# EAGLE design Sensor_board (EAGLE 7.7.0)
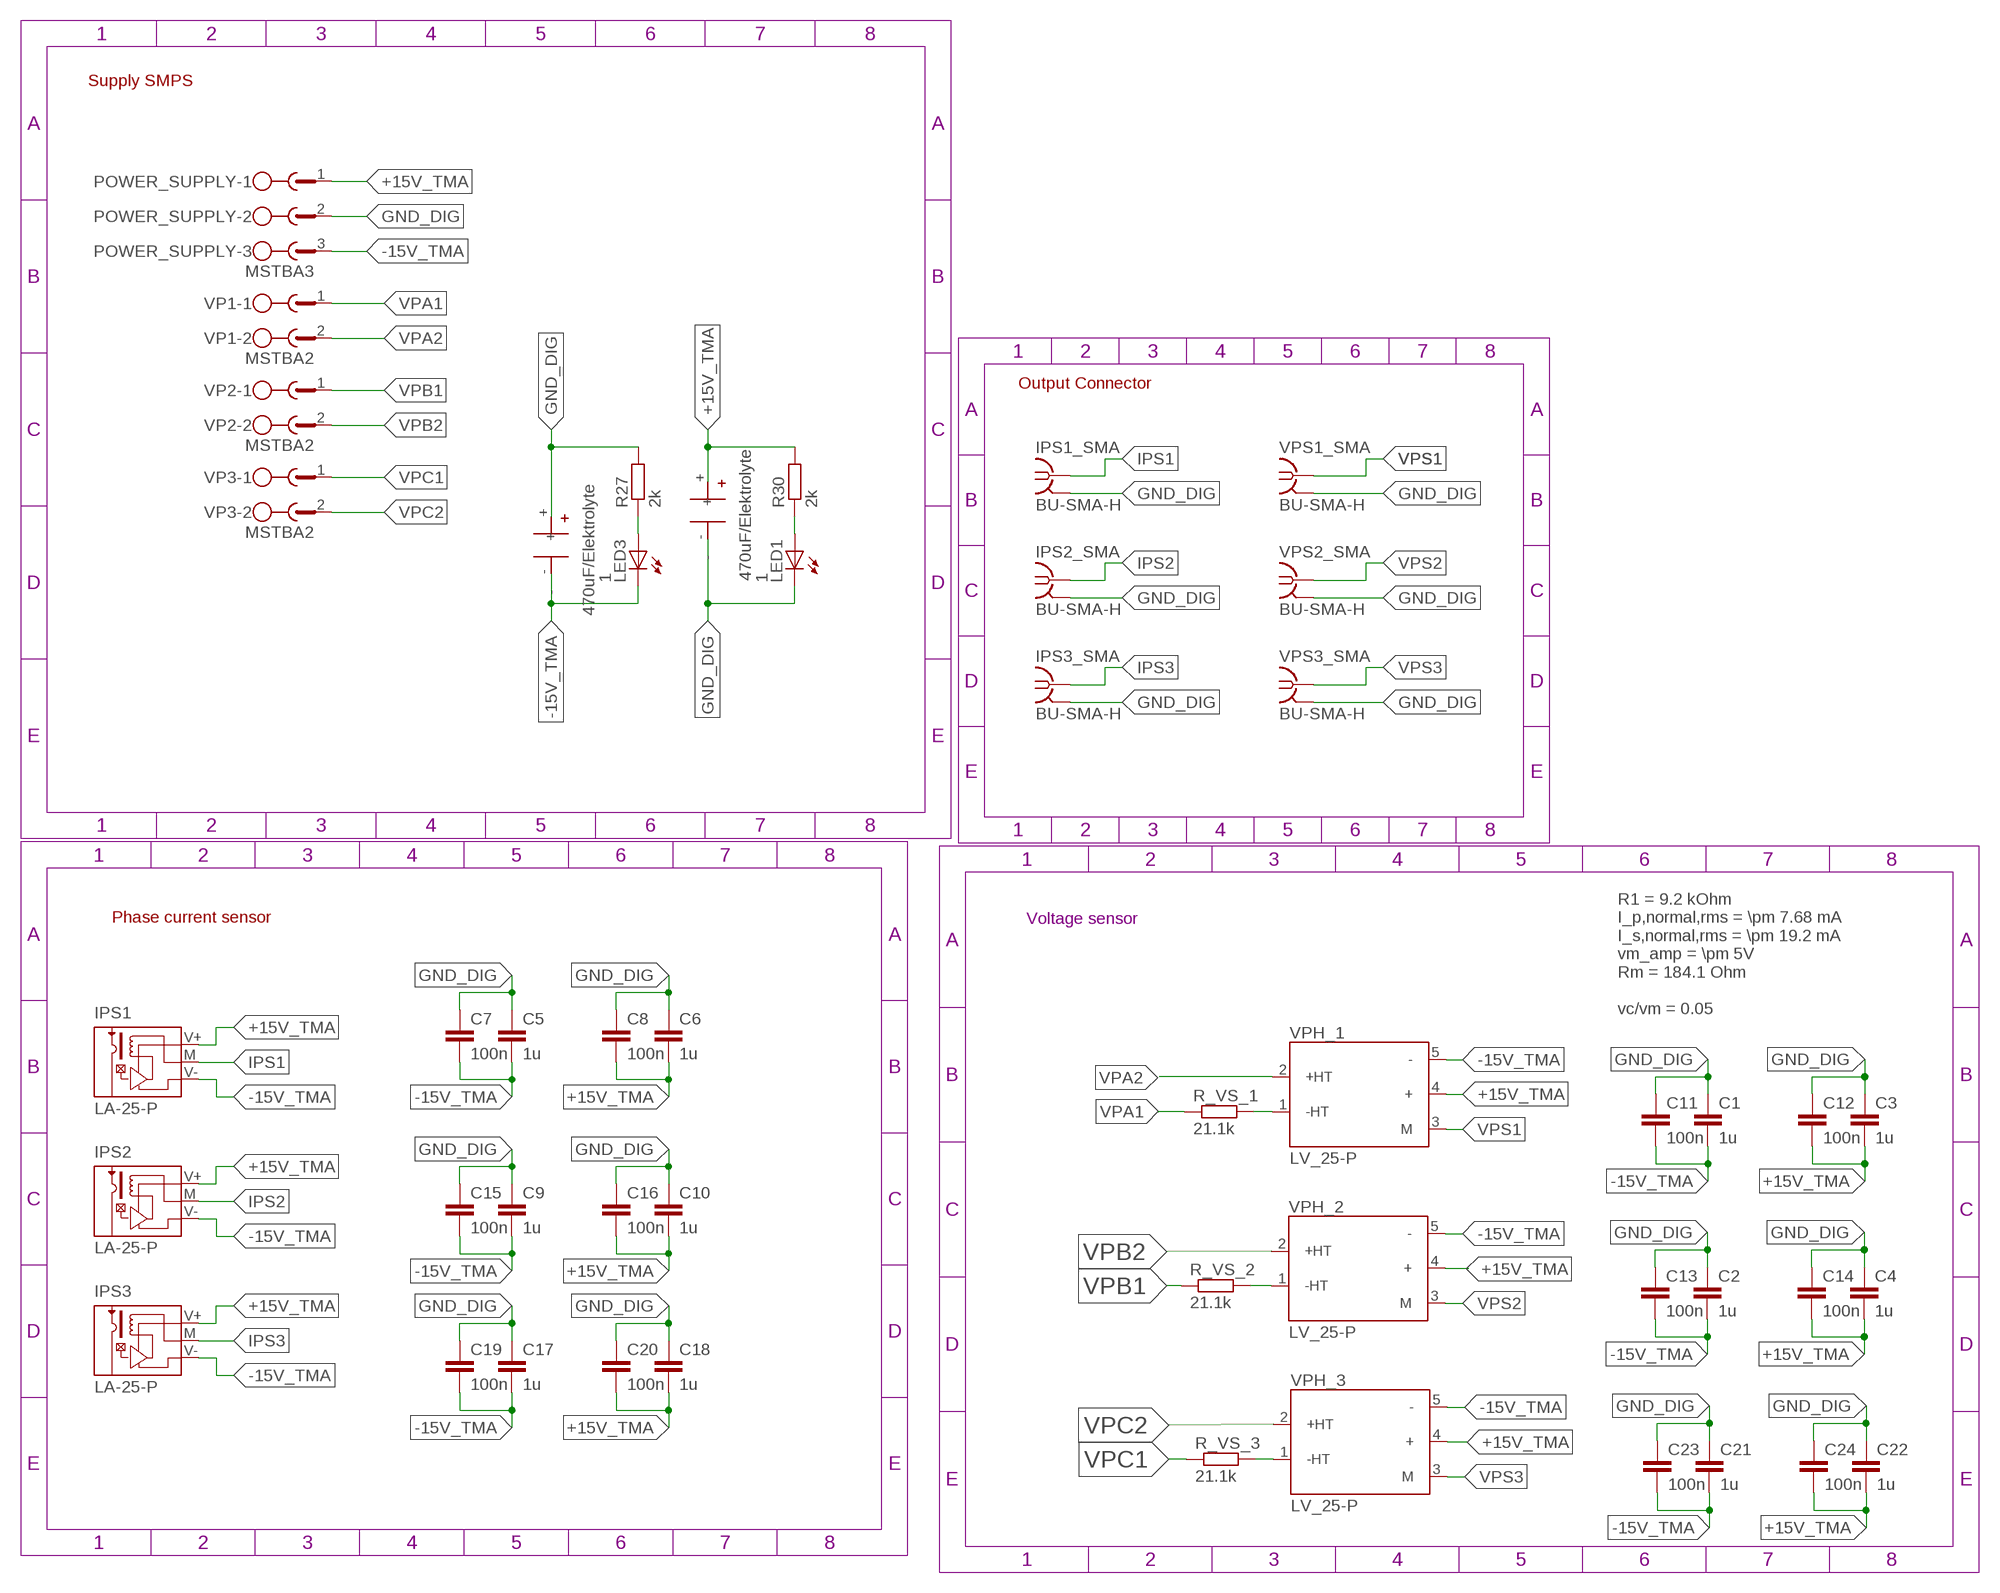
[diagram p0: schematic, sheet 1]

## Parts
C1  1u  C-EUC0805  [C0805]
C2  1u  C-EUC0805  [C0805]
C3  1u  C-EUC0805  [C0805]
C4  1u  C-EUC0805  [C0805]
C5  1u  C-EUC0805  [C0805]
C6  1u  C-EUC0805  [C0805]
C7  100n  C-EUC0805  [C0805]
C8  100n  C-EUC0805  [C0805]
C9  1u  C-EUC0805  [C0805]
C10  1u  C-EUC0805  [C0805]
C11  100n  C-EUC0805  [C0805]
C12  100n  C-EUC0805  [C0805]
C13  100n  C-EUC0805  [C0805]
C14  100n  C-EUC0805  [C0805]
C15  100n  C-EUC0805  [C0805]
C16  100n  C-EUC0805  [C0805]
C17  1u  C-EUC0805  [C0805]
C18  1u  C-EUC0805  [C0805]
C19  100n  C-EUC0805  [C0805]
C20  100n  C-EUC0805  [C0805]
C21  1u  C-EUC0805  [C0805]
C22  1u  C-EUC0805  [C0805]
C23  100n  C-EUC0805  [C0805]
C24  100n  C-EUC0805  [C0805]
C31  ELE_C_470UF_PAN  [ELEK_C_470UF_PAN]
C32  ELE_C_470UF_PAN  [ELEK_C_470UF_PAN]
IPS1  LA-25-P  [LA25P]
IPS1_SMA  BU-SMA-H  [BU-SMA-H]
IPS2  LA-25-P  [LA25P]
IPS2_SMA  BU-SMA-H  [BU-SMA-H]
IPS3  LA-25-P  [LA25P]
IPS3_SMA  BU-SMA-H  [BU-SMA-H]
LED1  1  LEDCHIPLED_0805  [CHIPLED_0805]
LED3  1  LEDCHIPLED_0805  [CHIPLED_0805]
POWER_SUPPLY  MSTBA3  [MSTBA3]
R27  2k  R-EU_R0805  [R0805]
R30  2k  R-EU_R0805  [R0805]
R_VS_1  21.1k  R-EU_0414/15  [0414/15]
R_VS_2  21.1k  R-EU_0414/15  [0414/15]
R_VS_3  21.1k  R-EU_0414/15  [0414/15]
VP1  MSTBA2  [MSTBA2]
VP2  MSTBA2  [MSTBA2]
VP3  MSTBA2  [MSTBA2]
VPH_1  LV_25-P  [XDCR_LV25-P]
VPH_2  LV_25-P  [XDCR_LV25-P]
VPH_3  LV_25-P  [XDCR_LV25-P]
VPS1_SMA  BU-SMA-H  [BU-SMA-H]
VPS2_SMA  BU-SMA-H  [BU-SMA-H]
VPS3_SMA  BU-SMA-H  [BU-SMA-H]

## Nets
+15V_TMA: C3.2 C4.2 C6.2 C8.2 C10.2 C12.2 C14.2 C16.2 C18.2 C20.2 C22.2 C24.2 C32.+ IPS1.V+ IPS2.V+ IPS3.V+ POWER_SUPPLY.1 R30.2 VPH_1.4(+) VPH_2.4(+) VPH_3.4(+)
-15V_TMA: C1.2 C2.2 C5.2 C7.2 C9.2 C11.2 C13.2 C15.2 C17.2 C19.2 C21.2 C23.2 C31.- IPS1.V- IPS2.V- IPS3.V- LED3.C POWER_SUPPLY.3 VPH_1.5(-) VPH_2.5(-) VPH_3.5(-)
GND_DIG: C1.1 C2.1 C3.1 C4.1 C5.1 C6.1 C7.1 C8.1 C9.1 C10.1 C11.1 C12.1 C13.1 C14.1 C15.1 C16.1 C17.1 C18.1 C19.1 C20.1 C21.1 C22.1 C23.1 C24.1 C31.+ C32.- IPS1_SMA.2 IPS1_SMA.3 IPS1_SMA.4 IPS1_SMA.5 IPS2_SMA.2 IPS2_SMA.3 IPS2_SMA.4 IPS2_SMA.5 IPS3_SMA.2 IPS3_SMA.3 IPS3_SMA.4 IPS3_SMA.5 LED1.C POWER_SUPPLY.2 R27.2 VPS1_SMA.2 VPS1_SMA.3 VPS1_SMA.4 VPS1_SMA.5 VPS2_SMA.2 VPS2_SMA.3 VPS2_SMA.4 VPS2_SMA.5 VPS3_SMA.2 VPS3_SMA.3 VPS3_SMA.4 VPS3_SMA.5
IPS1: IPS1.M IPS1_SMA.1
IPS2: IPS2.M IPS2_SMA.1
IPS3: IPS3.M IPS3_SMA.1
N$1: R_VS_1.2 VPH_1.1(-HT)
N$2: R_VS_2.2 VPH_2.1(-HT)
N$3: LED1.A R30.1
N$4: R_VS_3.2 VPH_3.1(-HT)
N$12: LED3.A R27.1
VPA1: R_VS_1.1 VP1.1
VPA2: VP1.2 VPH_1.2(+HT)
VPB1: R_VS_2.1 VP2.1
VPB2: VP2.2 VPH_2.2(+HT)
VPC1: R_VS_3.1 VP3.1
VPC2: VP3.2 VPH_3.2(+HT)
VPS1: VPH_1.3(M) VPS1_SMA.1
VPS2: VPH_2.3(M) VPS2_SMA.1
VPS3: VPH_3.3(M) VPS3_SMA.1

## Notes on the sheet
- Supply SMPS
- Output Connector
- Phase current sensor | Voltage sensor
- R1 = 9.2 kOhm
  I_p,normal,rms = \pm 7.68 mA
  I_s,normal,rms = \pm 19.2 mA
  vm_amp = \pm 5V
  Rm = 184.1 Ohm
  
  vc/vm = 0.05

## Library data of the parts
C1-C24 = rcl:C-EU: CAPACITOR, European symbol
C31 C32 = Submodule:ELE_C_470UF_PAN
IPS1-IPS3 = lem:LA-*: Current Transducer LA 100P For the electronic measurement of currents: DC, AC, pulsed..., Source: Data sheet <http://www.lem.com/docs/products/la%20100-p%20e.pdf>
IPS1_SMA IPS2_SMA IPS3_SMA VPS1_SMA VPS2_SMA VPS3_SMA = con-coax:BU-SMA-H: FEMALE SMA CONNECTOR Radiall; OC_FARNELL: unknown; OC_NEWARK: unknown
LED1 LED3 = led:LED: LED OSRAM: - CHIPLED LG R971, LG N971, LY N971, LG Q971, LY Q971, LO R971, LY R971 LH N974, LH R974 LS Q976, LO Q976, LY Q976 LO Q996 - Hyper CHIPLED LW Q18S LB Q993, LB Q99A, LB R99A - SideLED LS A670, LO A670, LY A670, LG A670, LP A670 LB A673, LV A673, LT A673, LW A673 LH A674 LY A675 LS A676, LA A676, LO A676, LY A676, LW A676 LS A679, LY A679, LG A679 - Hyper Micro SIDELED® LS Y876, LA Y876, LO Y876, LY Y876 LT Y87S - SmartLED LW L88C, LW L88S LB L89C, LB L89S, LG L890 LS L89K, LO L89K, LY L89K LS L896, LA L896, LO L896, LY L896 - TOPLED LS T670, LO T670, LY T670, LG T670, LP T670 LSG T670, LSP T670, LSY T670, LOP T670, LYG T670 LG T671, LOG T671, LSG T671 LB T673, LV T673, LT T673, LW T673 LH T674 LS T676, LA T676, LO T676, LY T676, LB T676, LH T676, LSB T676, LW T676 LB T67C, LV T67C, LT T67C, LS T67K, LO T67K, LY T67K, LW E67C LS E67B, LA E67B, LO E67B, LY E67B, LB E67C, LV E67C, LT E67C LW T67C LS T679, LY T679, LG T679 LS T770, LO T770, LY T770, LG T770, LP T770 LB T773, LV T773, LT T773, LW T773 LH T774 LS E675, LA E675, LY E675, LS T675 LS T776, LA T776, LO T776, LY T776, LB T776 LHGB T686 LT T68C, LB T68C - Hyper Mini TOPLED® LB M676 - Mini TOPLED Santana® LG M470 LS M47K, LO M47K, LY M47K Source: http://www.osram.convergy.de LUXEON: - LUMILED® LXK2-PW12-R00, LXK2-PW12-S00, LXK2-PW14-U00, LXK2-PW14-V00 LXK2-PM12-R00, LXK2-PM12-S00, LXK2-PM14-U00 LXK2-PE12-Q00, LXK2-PE12-R00, LXK2-PE12-S00, LXK2-PE14-T00, LXK2-PE14-U00 LXK2-PB12-K00, LXK2-PB12-L00, LXK2-PB12-M00, LXK2-PB14-N00, LXK2-PB14-P00, LXK2-PB14-Q00 LXK2-PR12-L00, LXK2-PR12-M00, LXK2-PR14-Q00, LXK2-PR14-R00 LXK2-PD12-Q00, LXK2-PD12-R00, LXK2-PD12-S00 LXK2-PH12-R00, LXK2-PH12-S00 LXK2-PL12-P00, LXK2-PL12-Q00, LXK2-PL12-R00 Source: www.luxeon.com KINGBRIGHT: KA-3528ASYC Source: www.kingbright.com
POWER_SUPPLY = con-phoenix-508:MSTBA3: PHOENIX; MF: FARNELL; MPN: 1757255; OC_FARNELL: 3705183; OC_NEWARK: 71C4162
R27 R30 R_VS_1-R_VS_3 = rcl:R-EU_: RESISTOR, European symbol
VP1-VP3 = con-phoenix-508:MSTBA2: PHOENIX; MF: FARNELL; MPN: 1757242; OC_FARNELL: 3705171; OC_NEWARK: 71C4161
VPH_1-VPH_3 = LV_25-P:LV_25-P: Transducer Voltage Close Loop 10ma - Lv 25-p; DESCRIPTION: Current transformer [LEM] LV 25-P Current transformer; DIGI-KEY_PART_NUMBER: 398-1019-ND; DIGI-KEY_PURCHASE_URL: https://www.digikey.com/product-detail/en/lem-usa-inc/LV-25-P/398-1019-ND/409832?utm_source=snapeda&utm_medium=aggregator&utm_campaign=symbol; MF: LEM USA; MP: LV 25-P; PACKAGE: TSSOP-14 LEM

## Board
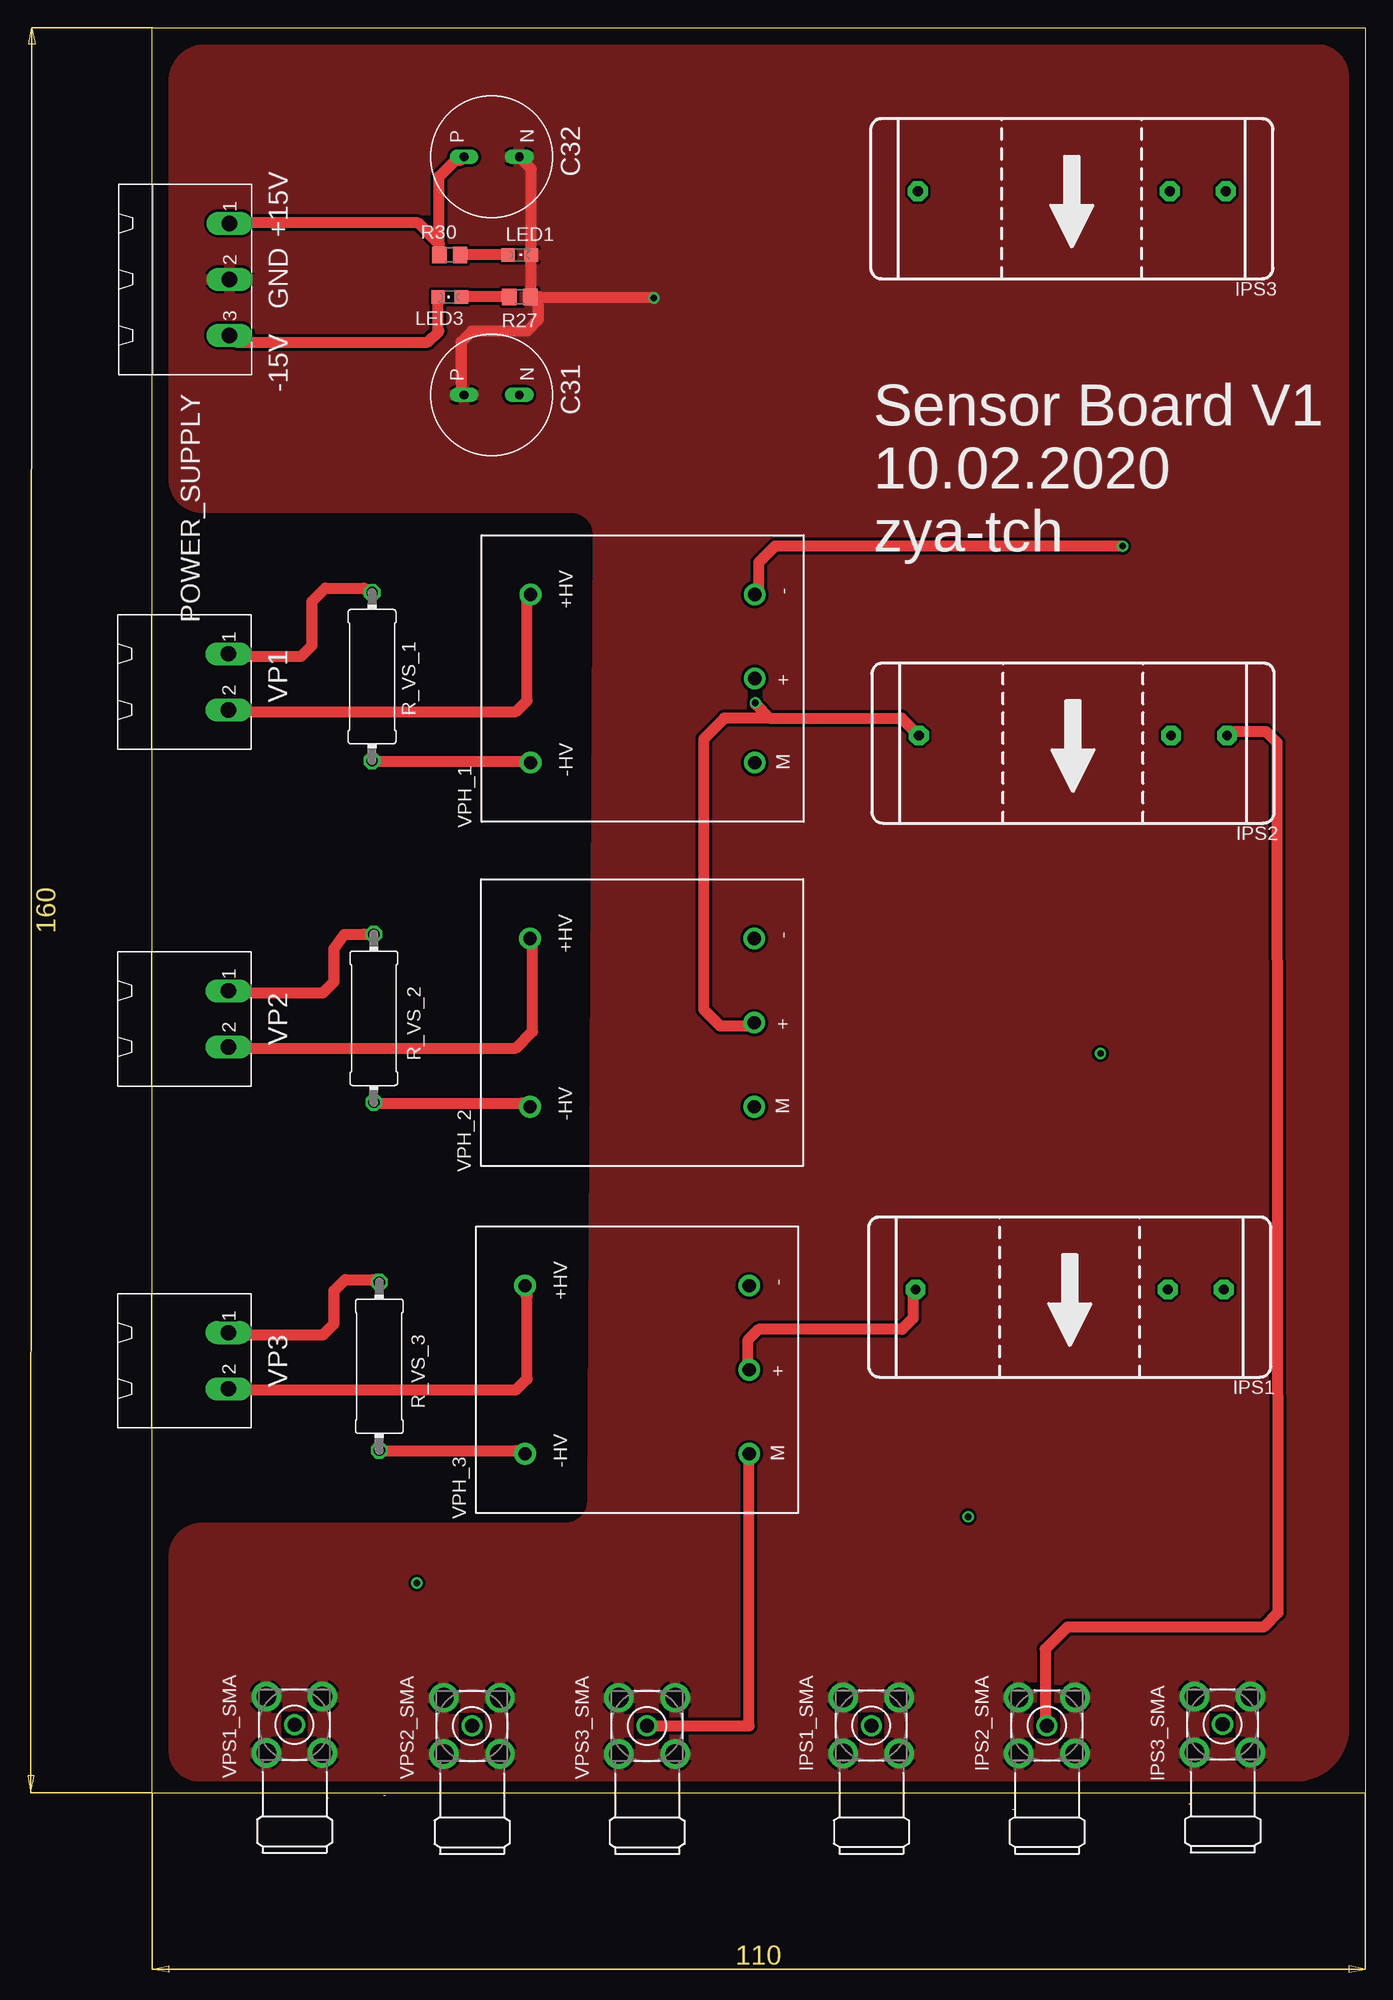
[diagram p1: board, top side]
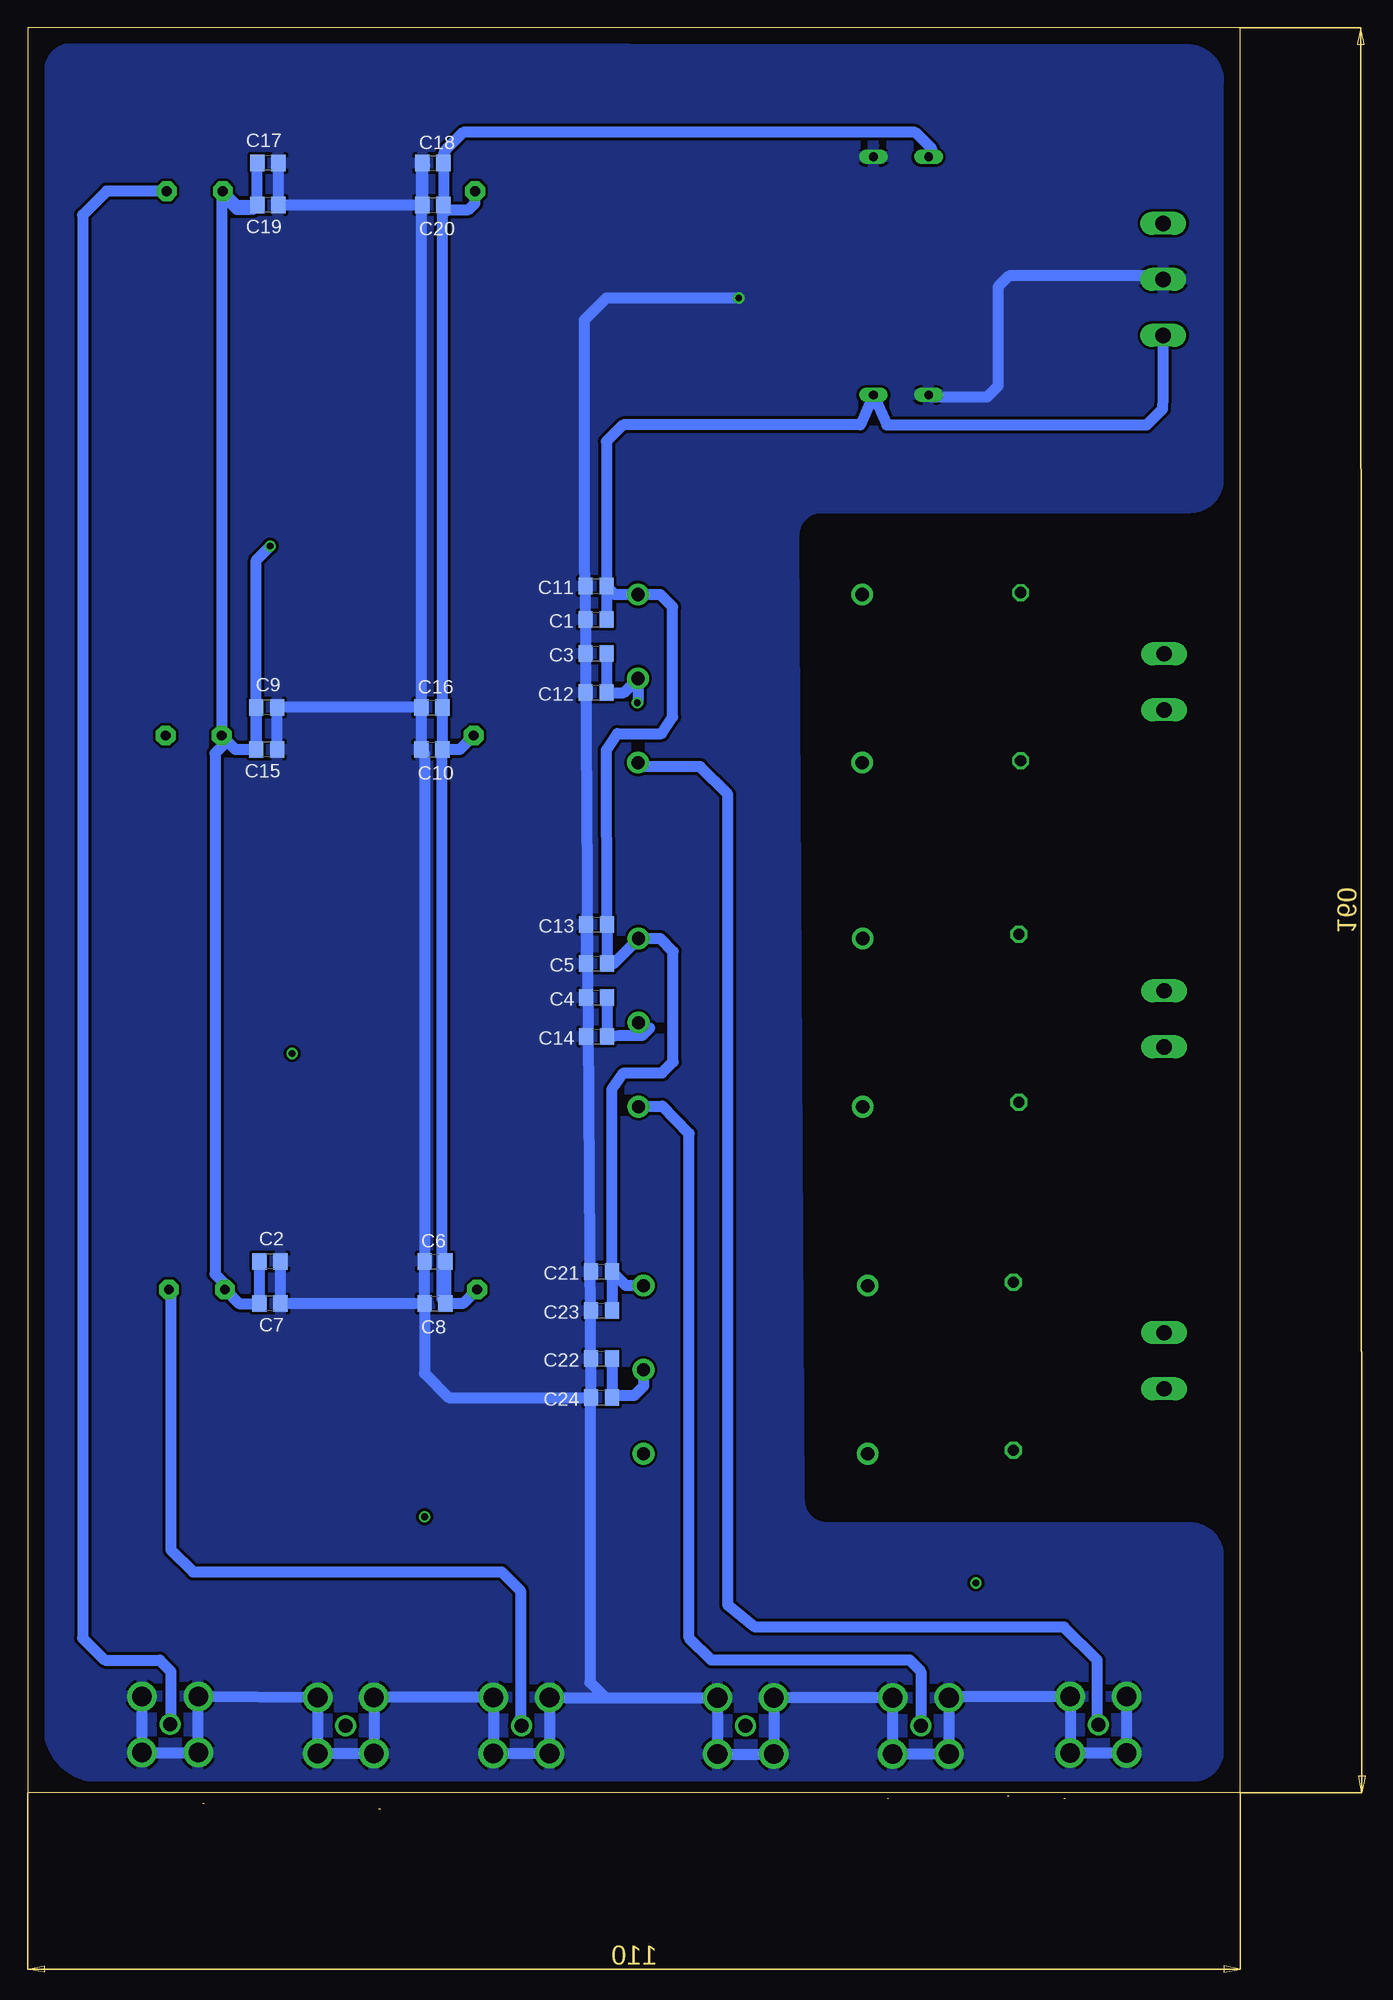
[diagram p2: board, bottom side, seen from below]

Size 110 x 161.5 mm. Coordinates in mm from the lower left corner, seen from the top.
Outline: 21.15,1.2 21,1.2
Outline: 16,1 15.9,1
Outline: 32,1 31.95,1
Outline: 94,0.5 94.1,0.5
Outline: 78,0 78.15,0
Outline: 0,1.5 110,1.5 110,161.5 0,161.5 0,1.5
Copper layers (1*16): Top 0.035mm / dielectric 1.5mm / Bottom 0.035mm
Design rules "default *": minimum track width 10mil, minimum drill 24mil, track to track 8mil, track to pad 8mil, pad to pad 8mil, via to via 8mil, smd to smd 8mil, copper to edge 40mil, drill to drill 12mil, minimum pad ring 10mil, minimum via ring 8mil, stop-mask expansion 4mil, vias tented up to drill 0mil, thermal gap 10mil

### Footprints (pad centres in the part's own frame; a part is rotated, then mirrored left to right if it is on the bottom)
C0805 = smd 1.3 x 1.5: 1 -0.95,0; 2 0.95,0
ELEK_C_470UF_PAN = drill 0.8 long: + 0,2.5; - 0,-2.5
LA25P = drill 0.9 pad 1.8 octagon: M -13.97,0; V+ 13.97,0; V- -8.89,0
BU-SMA-H = drill 1.27: 1 0,0 | drill 1.778: 2 -2.55,2.55; 3 2.55,2.55; 4 2.55,-2.55; 5 -2.55,-2.55
CHIPLED_0805 = smd 1.2 x 1.2: A 0,-1.05; C 0,1.05
MSTBA3 = drill 1.397 long: 1 -5.08,5.08; 2 0,5.08; 3 5.08,5.08
R0805 = smd 1.3 x 1.5: 1 -0.95,0; 2 0.95,0
0414/15 = drill 1.016 octagon: 1 -7.62,0; 2 7.62,0
MSTBA2 = drill 1.397 long: 1 -2.54,5.08; 2 2.54,5.08
XDCR_LV25-P = drill 1.2 pad 1.962: 1 -7.62,10.16; 2 7.62,10.16; 3 -7.62,-10.16; 4 0,-10.16; 5 7.62,-10.16

### Placement (x,y rotation side)
C1  58.45,107.84 0 bottom
C2  88.02,49.65 180 bottom
C3  58.45,104.76 0 bottom
C4  58.4,73.57 0 bottom
C5  58.4,76.65 0 bottom
C6  73.05,49.65 0 bottom
C7  88.02,45.84 180 bottom
C8  73.05,45.84 0 bottom
C9  88.32,99.87 180 bottom
C10  73.35,96.06 0 bottom
C11  58.45,110.88 0 bottom
C12  58.45,101.22 0 bottom
C13  58.4,80.19 0 bottom
C14  58.4,70.03 0 bottom
C15  88.32,96.06 180 bottom
C16  73.35,99.87 0 bottom
C17  88.21,149.22 180 bottom
C18  73.24,149.22 0 bottom
C19  88.21,145.41 180 bottom
C20  73.24,145.41 0 bottom
C21  57.95,48.73 0 bottom
C22  57.95,40.84 0 bottom
C23  57.95,45.19 0 bottom
C24  57.95,37.3 0 bottom
C31  30.79,128.2 90 top
C32  30.79,149.79 90 top
IPS1  83.21,47.11 180 top
IPS1_SMA  65.21,7.58 270 top
IPS2  83.51,97.33 180 top
IPS2_SMA  81.14,7.58 270 top
IPS3  83.4,146.68 180 top
IPS3_SMA  97.07,7.68 270 top
LED1  33.33,140.9 270 top
LED3  26.98,137.09 90 top
POWER_SUPPLY  1.93,138.68 270 top
R27  33.33,137.09 0 top
R30  26.98,140.9 180 top
R_VS_1  19.94,102.67 270 top
R_VS_2  20.1,71.7 270 top
R_VS_3  20.6,40.15 270 top
VP1  1.85,102.2 270 top
VP2  1.85,71.65 270 top
VP3  1.85,40.65 270 top
VPH_1  44.48,102.49 90 top
VPH_2  44.43,71.3 90 top
VPH_3  43.98,39.84 90 top
VPS1_SMA  12.9,7.65 270 top
VPS2_SMA  29,7.55 270 top
VPS3_SMA  44.88,7.55 270 top

### Tracks (layer width: path | path; a pad name or v marks a point on that pad's centre or on a via)
+15V_TMA  (via drill 0.61)
  Top 1.016: IPS1.V+ 69,46.87 69,44.5 68,43.5 55,43.5 54,42.5 54,39.98 VPH_3.4 | v54.7,100.3 54.7,100.2 56,98.9 | 56,98.9 67.97,98.9 IPS2.V+ | 56,98.9 51.9,98.9 50,97 50,72.5 51.5,71 54.29,71 VPH_2.4 | C32.+ 28,149.5 27.5,149.5 26,148 26.03,147.97 R30.2 26.03,141.87 24.1,143.8 7.05,143.8 POWER_SUPPLY.1
  Bottom 1.016: C6.2 C8.2 | C10.2 C16.2 72.4,144.48 71.88,145 | C4.2 C14.2 56.33,70.15 54.25,70.15 53.59,70.81 VPH_2.4 | C22.2 C24.2 56.8,37.5 55,37.5 54.14,38.36 VPH_3.4 | C3.2 C12.2 55.91,101.22 VPH_1.4 54.64,100.36 v54.7,100.3 | 71.88,145 C20.2 C18.2 72.29,149.81 arc45 72,150.5 70.5,152 29.5,152 28,150.5 28,150.08 C32.+ | 71.88,145 70,145 69.43,145.57 IPS3.V+ | IPS2.V+ 70.81,96.06 C10.2 | C8.2 72.4,46.14 C10.2 | IPS1.V+ 70.51,45.84 C8.2
-15V_TMA  (via drill 0.61)
  Top 1.016: POWER_SUPPLY.3 7.61,133 25,133 26,134 25.93,134.07 LED3.C | v88,114.5 56.5,114.5 55,113 55,110.47 VPH_1.5
  Bottom 0.406: IPS2.V- 92,97.33 92,96.7
  Bottom 1.016: C11.2 C1.2 | C2.2 C7.2 90.83,45.84 IPS1.V- 92.1,47.6 93,48.5 93,95.7 92,96.7 91.77,96.7 | C19.2 C17.2 | POWER_SUPPLY.3 7.01,128.01 7.05,126.95 8.5,125.5 32.09,125.5 C31.- 34.49,125.5 56,125.5 57.5,124 C11.2 | IPS3.V- 91.02,145.41 C19.2 | C9.2 C15.2 | C21.2 57,65.25 55.95,66.75 52.45,66.75 51.45,67.75 51.45,77.75 52.62,78.92 VPH_2.5 56.86,76.65 C5.2 C13.2 57.5,96 56.5,97.5 52.5,97.5 51.5,99 51.5,109 52.61,110.11 VPH_1.5 56.73,110.11 C11.2 | C19.2 89.56,145 91,145 92,146 92,147 92.4,146.6 IPS2.V- 91.13,96.06 C15.2 | C15.2 89.27,113.23 v88,114.5 | VPH_3.5 55.73,47.46 C21.2 | C21.2 C23.2
GND_DIG  (via drill 0.61)
  Top 1.016: v45.5,137 35.3,137 35.21,137.09 R27.2 | R27.2 34.38,137.19 LED1.C 34.38,148.7 C32.- | R27.2 35,136.37 35,135 34,134 29,134 28,133 28,128 28.2,128.2 C31.+
  Bottom 0.406: C11.1 C1.1 C3.1 C12.1 59.35,101.22 C5.1 C4.1 C14.1 | C21.1 C23.1 C22.1
  Bottom 1.016: C24.1 C22.1 | C2.1 C7.1 C8.1 | C17.1 C19.1 C20.1 74.19,148.78 | C8.1 C6.1 74,95.76 C10.1 C16.1 | C13.1 C5.1 | C16.1 C9.1 C15.1 | C24.1 59,37.3 59,11.5 57.6,10.1 VPS3_SMA.2 | VPS3_SMA.2 VPS3_SMA.3 VPS3_SMA.4 VPS3_SMA.5 VPS2_SMA.2 VPS2_SMA.3 VPS2_SMA.4 26.45,9.5 | VPS2_SMA.5 26.45,9.5 | VPS1_SMA.5 VPS1_SMA.4 VPS1_SMA.3 VPS1_SMA.2 25.75,10.2 26.45,9.5 | VPS3_SMA.2 61.13,10.1 IPS1_SMA.5 IPS1_SMA.4 IPS1_SMA.3 IPS1_SMA.2 IPS2_SMA.5 IPS2_SMA.4 IPS2_SMA.3 IPS2_SMA.2 IPS3_SMA.5 IPS3_SMA.4 IPS3_SMA.3 IPS3_SMA.2 | v45.5,137 57.5,137 59.5,135 59.5,112.48 C11.1 C24.1 | POWER_SUPPLY.2 7.33,139 21,139 22,138 22,129 23,128 28.09,128 C31.+ | C18.1 73.97,149 74.19,148.78 | C8.1 74,39.5 71.8,37.3 C24.1 | 74.19,148.78 74.3,148.67 C16.1
  pour Bottom (isolate 0.254): 108,157.46 108,6.52 arc-90 102.48,3 4.56,3 arc-90 2,5.06 2,22.96 arc-90 4.54,25.5 37.46,25.5 arc90 40,28.04 40.5,115.46 arc90 37.96,118 4.54,118 arc-90 2,120.54 2,156.5 arc-90 4.64,159.5 106.16,159.6 arc-90
  pour Top (isolate 0.254): 108,156.66 108,6.72 arc-90 102.98,3 4.56,3 arc-90 2,5.06 2,22.96 arc-90 4.54,25.5 37.46,25.5 arc90 40,28.04 40.5,115.46 arc90 37.96,118 4.54,118 arc-90 2,120.54 2,156.5 arc-90 4.64,159.5 105.96,159.5 arc-90
IPS1
  Bottom 0.406: IPS1_SMA.1 65.1,7.58 65.1,7.4
  Bottom 1.016: IPS1.M arc45 97,46.67 97,23.5 95,21.5 67,21.5 65.3,19.8 65.3,7.67 IPS1_SMA.1 | 65.5,7.87 65.5,8 65.21,7.71 IPS1_SMA.1 | 65.5,7.87 IPS1_SMA.1 | 65.5,7.87 65.5,7.5 65,7.5 | 65.21,7.51 65.1,7.4
IPS2
  Top 1.016: IPS2.M arc-45 98.37,97.7 101,97.7 102,96.7 102.1,17.8 100.8,16.5 83,16.5 81,14.5 81,7.72 IPS2_SMA.1
IPS3
  Bottom 1.016: IPS3.M 102.82,146.68 105,144.5 105,15.5 103,13.5 98,13.5 97,12.5 97,7.75 IPS3_SMA.1
N$1
  Top 1.016: R_VS_1.2 19.99,95 34,95 34.13,94.87 VPH_1.1
N$2
  Top 1.016: R_VS_2.2 20.18,64 33.5,64 33.82,63.68 VPH_2.1
N$3
  Top 1.016: LED1.A R30.1
N$4
  Top 1.016: R_VS_3.2 20.63,32.5 33,32.5 33.28,32.22 VPH_3.1
N$8  (via drill 0.61)
  other vias: 86,68.5
N$10  (via drill 0.61)
  other vias: 74,26.5
N$12
  Top 1.016: R27.1 LED3.A
N$15  (via drill 0.61)
  other vias: 24,20.5
VPA1
  Top 1.016: VP1.1 7.17,104.5 13.5,104.5 14.5,105.5 14.5,109.5 15.7,110.7 19.2,110.7 19.61,110.29 R_VS_1.1
VPA2
  Top 1.016: VP1.2 7.09,99.5 33,99.5 34,100.5 34,109.5 34.32,109.82 VPH_1.2
VPB1
  Top 1.016: VP2.1 7.12,74 15.5,74 16.5,75 16.5,78 17.45,79.3 18.95,79.3 19.18,79.32 R_VS_2.1
VPB2
  Top 1.016: VP2.2 7.04,69 33,69 34.5,70.5 34.5,78.5 34.27,78.73 VPH_2.2
VPC1
  Top 1.016: VP3.1 7.12,43 15.5,43 16.5,44 16.5,47 17.5,48 20,48 20.23,47.77 R_VS_3.1
VPC2
  Top 1.016: VP3.2 7.04,38 33,38 34,39 34,46.5 33.82,46.68 VPH_3.2
VPS1
  Bottom 1.016: VPS1_SMA.1 13,7.8 13,13.5 16,16.5 44.01,16.5 46.5,18.5 46.5,92 49,94.5 54.27,94.5 VPH_1.3
VPS2
  Bottom 1.016: VPH_2.3 52.52,63.68 52.45,63.75 50,61.25 50,15.5 48,13.5 30,13.5 29,12.5 VPS2_SMA.1
VPS3
  Top 1.016: VPS3_SMA.1 54.14,7.55 VPH_3.3

### Text on the board
tNames: C32 | +15V | GND | -15V | C31 | Sensor Board V1 / 10.02.2020 / zya-tch